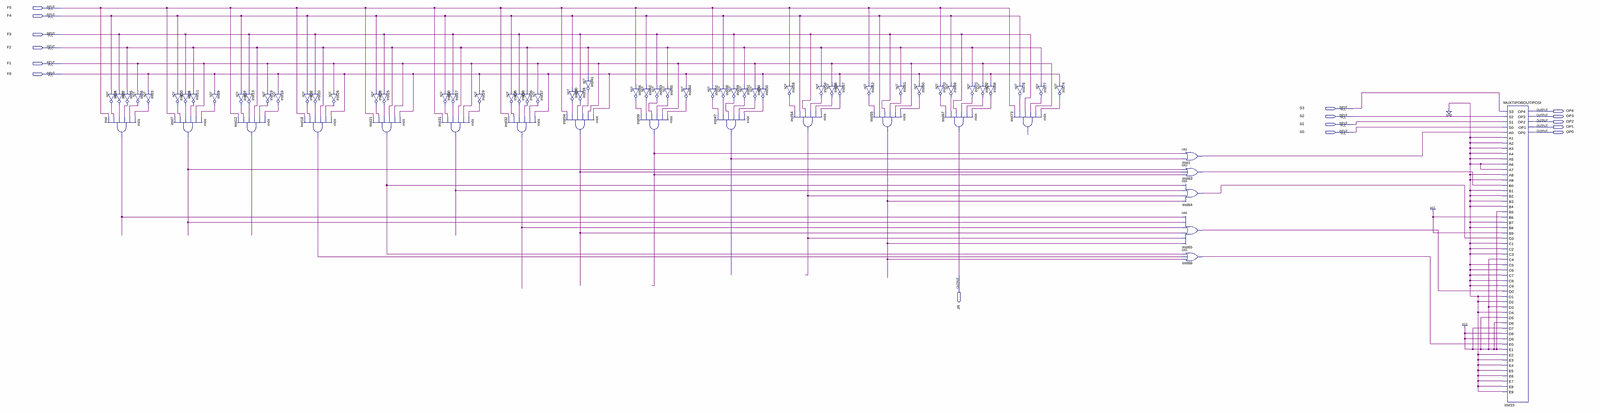
[diagram p0: schematic sheet, whole]
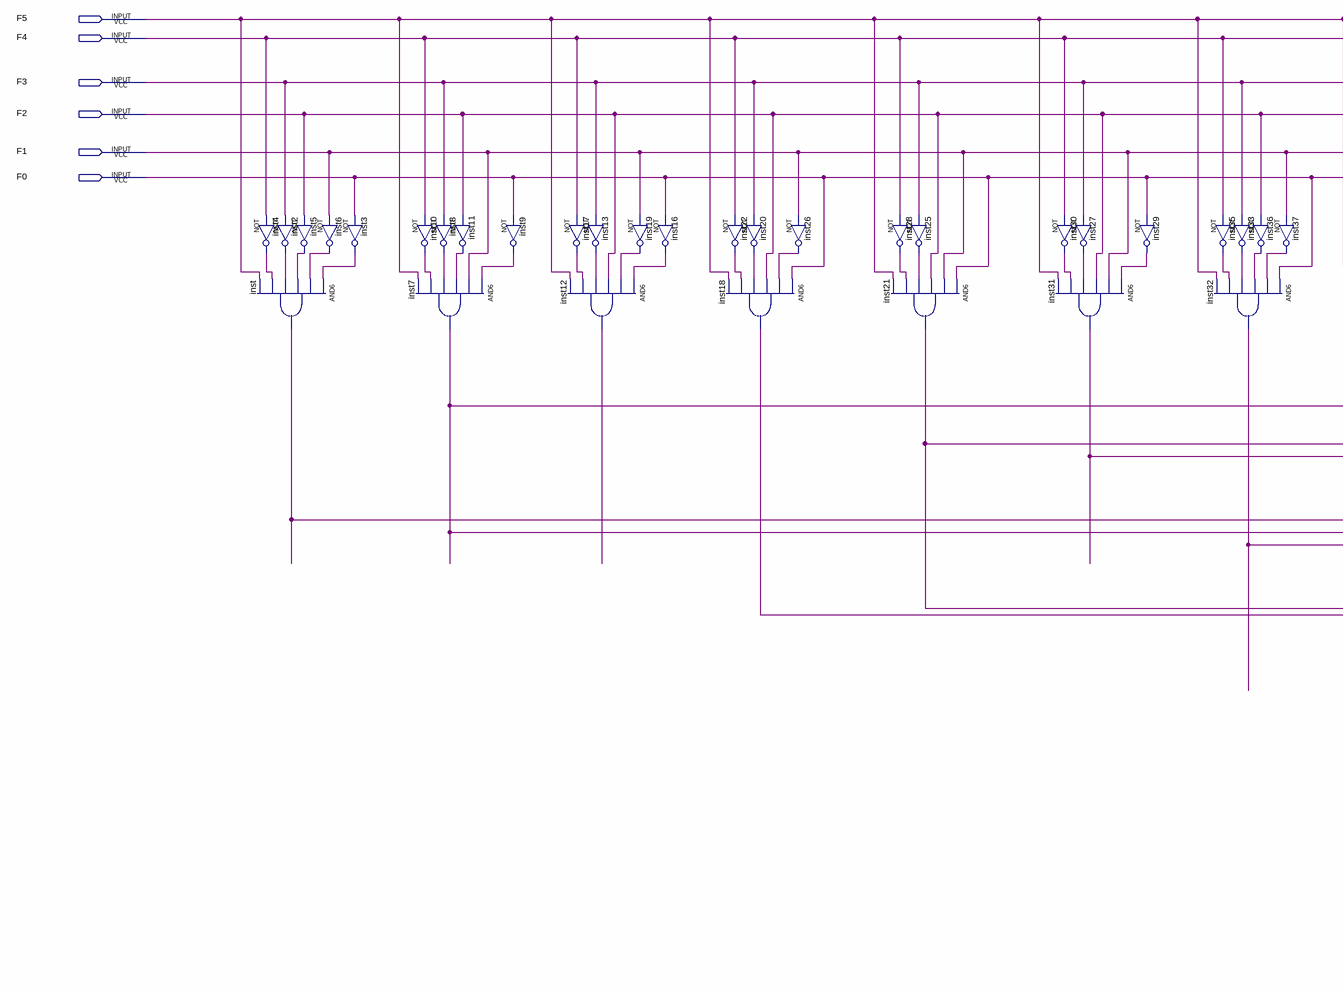
[diagram p1: schematic sheet, left part]
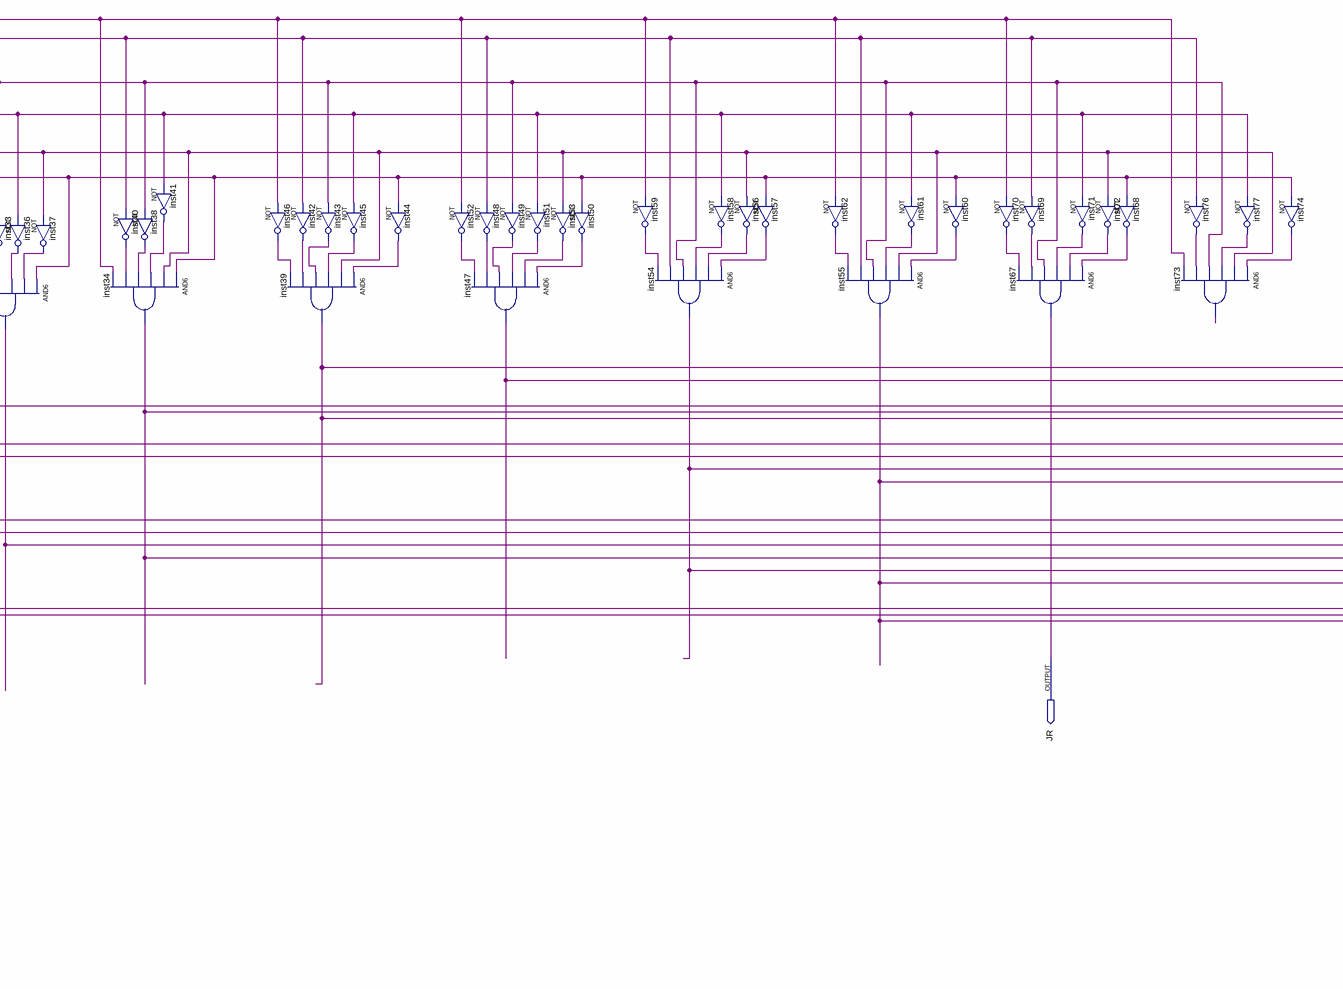
[diagram p2: schematic sheet, centre part]
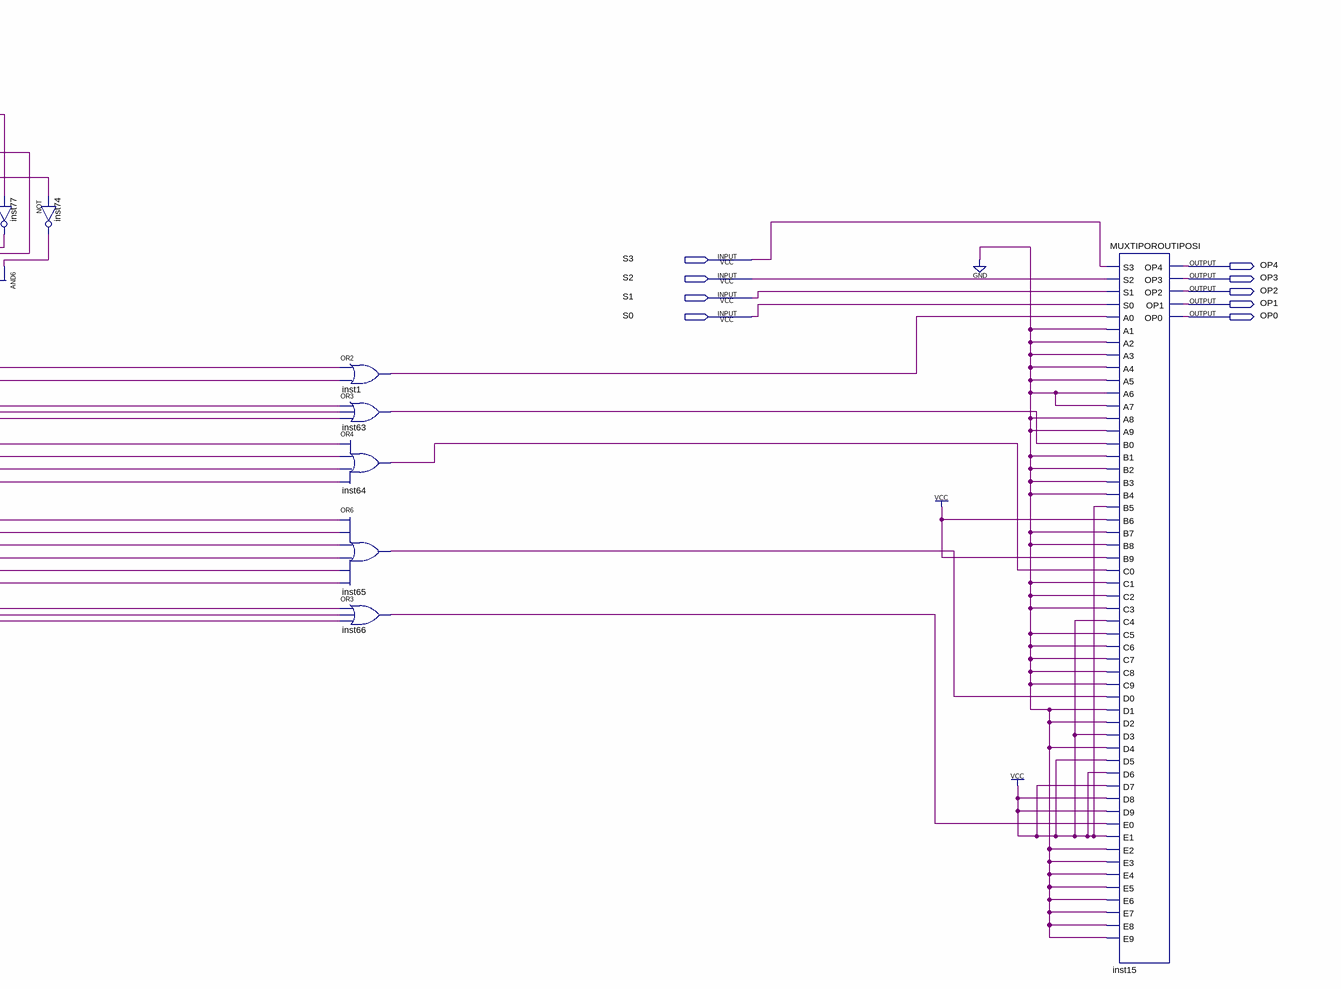
[diagram p3: schematic sheet, right part]
// Quartus schematic CONTROLE.bdf as structural Verilog: 74 symbols, 16 pins
module CONTROLE (
  input  F5,
  input  F4,
  input  F3,
  input  F2,
  input  F1,
  input  F0,
  input  S3,
  input  S2,
  input  S1,
  input  S0,
  output OP4,
  output OP3,
  output OP2,
  output OP1,
  output OP0,
  output JR
);

  wire inst1_out, inst2_out, inst3_out, inst4_out, inst5_out, inst6_out, inst7_out, inst8_out, inst9_out,
       inst10_out, inst11_out, inst12_out, inst13_out, inst16_out, inst17_out, inst18_out, inst19_out,
       inst20_out, inst21_out, inst22_out, inst25_out, inst26_out, inst27_out, inst28_out, inst29_out,
       inst30_out, inst31_out, inst32_out, inst33_out, inst34_out, inst35_out, inst36_out, inst37_out,
       inst38_out, inst39_out, inst40_out, inst41_out, inst42_out, inst43_out, inst44_out, inst45_out,
       inst46_out, inst47_out, inst48_out, inst49_out, inst50_out, inst51_out, inst52_out, inst53_out,
       inst54_out, inst55_out, inst56_out, inst57_out, inst58_out, inst59_out, inst60_out, inst61_out,
       inst62_out, inst63_out, inst64_out, inst65_out, inst66_out, inst68_out, inst69_out, inst70_out,
       inst71_out, inst72_out, inst73_out, inst74_out, inst76_out, inst77_out, inst_out;

  and inst (inst_out, inst3_out, inst6_out, inst5_out, inst2_out, inst4_out, F5);
  not inst2 (inst2_out, F3);
  not inst4 (inst4_out, F4);
  not inst5 (inst5_out, F2);
  not inst3 (inst3_out, F0);
  not inst6 (inst6_out, F1);
  not inst8 (inst8_out, F3);
  not inst10 (inst10_out, F4);
  not inst11 (inst11_out, F2);
  and inst7 (inst7_out, inst9_out, F1, inst11_out, inst8_out, inst10_out, F5);
  not inst9 (inst9_out, F0);
  not inst13 (inst13_out, F3);
  not inst17 (inst17_out, F4);
  and inst12 (inst12_out, inst16_out, inst19_out, F2, inst13_out, inst17_out, F5);
  not inst16 (inst16_out, F0);
  not inst19 (inst19_out, F1);
  not inst20 (inst20_out, F3);
  not inst22 (inst22_out, F4);
  and inst18 (inst18_out, F0, inst26_out, F2, inst20_out, inst22_out, F5);
  not inst26 (inst26_out, F1);
  not inst25 (inst25_out, F3);
  not inst28 (inst28_out, F4);
  and inst21 (inst21_out, F0, F1, F2, inst25_out, inst28_out, F5);
  not inst30 (inst30_out, F4);
  and inst31 (inst31_out, inst29_out, F1, F2, inst27_out, inst30_out, F5);
  not inst27 (inst27_out, F3);
  not inst29 (inst29_out, F0);
  not inst35 (inst35_out, F4);
  and inst32 (inst32_out, F0, inst37_out, inst36_out, inst33_out, inst35_out, F5);
  not inst33 (inst33_out, F3);
  not inst36 (inst36_out, F2);
  not inst37 (inst37_out, F1);
  not inst40 (inst40_out, F4);
  and inst34 (inst34_out, F0, F1, inst41_out, inst38_out, inst40_out, F5);
  not inst41 (inst41_out, F2);
  not inst38 (inst38_out, F3);
  not inst46 (inst46_out, F5);
  not inst42 (inst42_out, F4);
  not inst43 (inst43_out, F3);
  and inst39 (inst39_out, inst44_out, F1, inst45_out, inst43_out, inst42_out, inst46_out);
  not inst45 (inst45_out, F2);
  not inst44 (inst44_out, F0);
  not inst48 (inst48_out, F4);
  not inst52 (inst52_out, F5);
  and inst47 (inst47_out, inst50_out, inst53_out, inst51_out, inst49_out, inst48_out, inst52_out);
  not inst49 (inst49_out, F3);
  not inst51 (inst51_out, F2);
  not inst50 (inst50_out, F0);
  not inst53 (inst53_out, F1);
  not inst59 (inst59_out, F5);
  and inst54 (inst54_out, inst57_out, inst56_out, inst58_out, F3, F4, inst59_out);
  not inst58 (inst58_out, F2);
  not inst57 (inst57_out, F0);
  not inst56 (inst56_out, F1);
  not inst62 (inst62_out, F5);
  and inst55 (inst55_out, inst60_out, F1, inst61_out, F3, F4, inst62_out);
  not inst61 (inst61_out, F2);
  not inst60 (inst60_out, F0);
  not inst70 (inst70_out, F5);
  not inst69 (inst69_out, F4);
  and inst67 (JR, inst68_out, inst72_out, inst71_out, F3, inst69_out, inst70_out);
  not inst71 (inst71_out, F2);
  not inst68 (inst68_out, F0);
  not inst72 (inst72_out, F1);
  not inst76 (inst76_out, F4);
  and inst73 (inst73_out, inst74_out, F1, inst77_out, F3, inst76_out, F5);
  not inst77 (inst77_out, F2);
  not inst74 (inst74_out, F0);
  or inst1 (inst1_out, inst39_out, inst47_out);
  or inst63 (inst63_out, inst7_out, inst34_out, inst39_out);
  or inst64 (inst64_out, inst21_out, inst31_out, inst54_out, inst55_out);
  or inst65 (inst65_out, inst_out, inst7_out, inst32_out, inst34_out, inst54_out, inst55_out);
  or inst66 (inst66_out, inst21_out, inst18_out, inst55_out);
  MUXTIPOROUTIPOSI inst15 (
    .S3(S3), .S2(S2), .S1(S1), .S0(S0), .A0(inst1_out), .A1(1'b0), .A2(1'b0), .A3(1'b0), .A4(1'b0),
    .A5(1'b0), .A6(1'b0), .A7(1'b0), .A8(1'b0), .A9(1'b0), .B0(inst63_out), .B1(1'b0), .B2(1'b0), .B3(1'b0),
    .B4(1'b0), .B5(1'b1), .B6(1'b1), .B7(1'b0), .B8(1'b0), .B9(1'b1), .C0(inst64_out), .C1(1'b0), .C2(1'b0),
    .C3(1'b0), .C4(1'b1), .C5(1'b0), .C6(1'b0), .C7(1'b0), .C8(1'b0), .C9(1'b0), .D0(inst65_out), .D1(1'b0),
    .D2(1'b0), .D3(1'b1), .D4(1'b0), .D5(1'b1), .D6(1'b1), .D7(1'b1), .D8(1'b1), .D9(1'b1), .E0(inst66_out),
    .E1(1'b1), .E2(1'b0), .E3(1'b0), .E4(1'b0), .E5(1'b0), .E6(1'b0), .E7(1'b0), .E8(1'b0), .E9(1'b0),
    .OP4(OP4), .OP3(OP3), .OP2(OP2), .OP1(OP1), .OP0(OP0));
endmodule
